# Altium schematic sheet LCDCircuit.SchDoc
size A; SheetNumber: 4; SheetTotal: 9
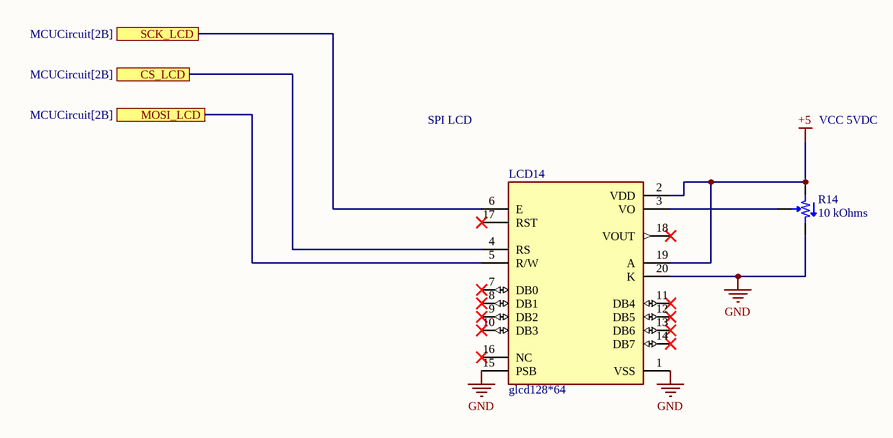
[diagram p0: LCDCircuit.SchDoc]

## Parts
LCD14  glcd128*64  [GLCD128*64]
R14  10 kOhms  [BOURNS TRIMPOT 3386P-1]

## Ports
CS_LCD (see MCUCircuit[2B]), MOSI_LCD (see MCUCircuit[2B]), SCK_LCD (see MCUCircuit[2B])

## Nets
+5: LCD14.2(VDD) LCD14.19(A) R14.1
GND: LCD14.1(VSS) LCD14.15(PSB) LCD14.20(K) R14.3
CS_LCD: LCD14.4(RS) ; port CS_LCD
MOSI_LCD: LCD14.5(R/W) ; port MOSI_LCD
SCK_LCD: LCD14.6(E) ; port SCK_LCD
NetLCD14_3: LCD14.3(VO) R14.2

Not connected (* = marked no-connect by the designer): LCD14 7(DB0)* 8(DB1)* 9(DB2)* 10(DB3)* 11(DB4)* 12(DB5)* 13(DB6)* 14(DB7)* 16(NC)* 17(RST)* 18(VOUT)*

## Notes on the sheet
- SPI LCD
- VCC 5VDC

## Library data of the parts
R14 = 3386P-1-103LF: TRIMMER 10K OHM 0.5W PC PIN TOP; Manufacturer: Bourns Inc.; Adjustment Type: Top Adjustment; Number of Turns: 1; Power (Watts): 0.5W, 1/2W; Resistive Material: Cermet; Temperature Coefficient: ±100ppm/°C; Tolerance: ±10%; Part Number: 3386P-1-103LF; ComponentLink1Description: Datasheet; ComponentLink1URL: https://www.bourns.com/docs/Product-Datasheets/3386.pdf; ComponentLink2Description: DigiKey Link; ComponentLink2URL: https://www.digikey.com/en/products/detail/bourns-inc/3386P-1-103LF/1088523; LastUpdated: 3/11/2024 08:14:33; Lifecycle Status: Active; Minimum Order: 1; Mounting Type: Through Hole; Packaging: Tube; PartId: 100; Part Status: Active; Price: 0.72; Resistance: 10 kOhms; Series: Trimpot® 3386 - Sealed; Size / Dimension: Square - 0.375" x 0.375" Face (9.53mm x 9.53mm); Supplier 1: DigiKey; Supplier Part Number 1: 3386P-103LF-ND; Termination Style: PC Pins; Value: 10 kOhms